# EAGLE design Blinds Driver (EAGLE 7.3.0)
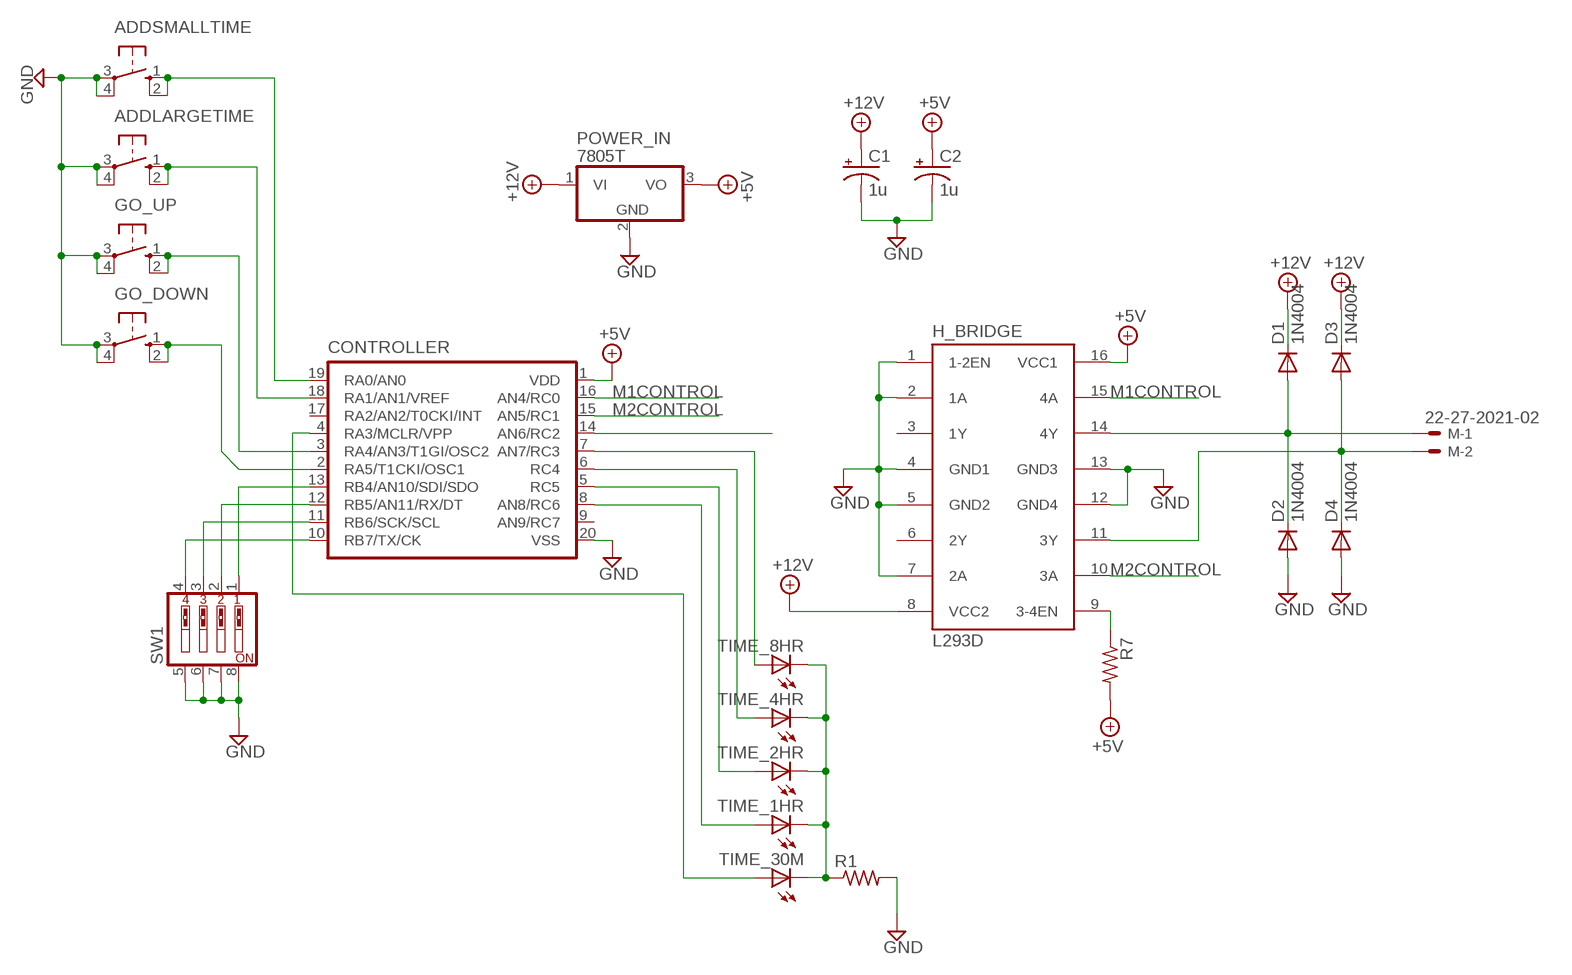
[diagram p0: schematic, sheet 1]

## Parts
ADDLARGETIME  10-XX  [B3F-10XX]
ADDSMALLTIME  10-XX  [B3F-10XX]
C1  1u  CPOL-USE2,5-6E  [E2,5-6E]
C2  1u  CPOL-USE2,5-6E  [E2,5-6E]
CONTROLLER  PIC16F6XX  [DIL20]
D1  1N4004  [DO41-10]
D2  1N4004  [DO41-10]
D3  1N4004  [DO41-10]
D4  1N4004  [DO41-10]
GO_DOWN  10-XX  [B3F-10XX]
GO_UP  10-XX  [B3F-10XX]
H_BRIDGE  L293D  [DIL16]
M  22-27-2021-02  [6410-02]
POWER_IN  7805T  [TO220H]
R1  R-US_0207/10  [0207/10]
R7  R-US_0207/10  [0207/10]
SW1  SW_DIP-4  [EDG-04]
TIME_1HR  LED5MM  [LED5MM]
TIME_2HR  LED5MM  [LED5MM]
TIME_4HR  LED5MM  [LED5MM]
TIME_8HR  LED5MM  [LED5MM]
TIME_30M  LED5MM  [LED5MM]

## Nets
+5V: C2.+ CONTROLLER.1(VDD) H_BRIDGE.16(VCC1) POWER_IN.3(VO) R7.2
+12V: C1.+ D1.C D3.C H_BRIDGE.8(VCC2) POWER_IN.1(VI)
GND: ADDLARGETIME.3(P) ADDLARGETIME.4(P1) ADDSMALLTIME.3(P) ADDSMALLTIME.4(P1) C1.- C2.- CONTROLLER.20(VSS) D2.A D4.A GO_DOWN.3(P) GO_DOWN.4(P1) GO_UP.3(P) GO_UP.4(P1) H_BRIDGE.1(1-2EN) H_BRIDGE.2(1A) H_BRIDGE.4(GND1) H_BRIDGE.5(GND2) H_BRIDGE.7(2A) H_BRIDGE.12(GND4) H_BRIDGE.13(GND3) POWER_IN.2(GND) R1.2 SW1.5 SW1.6 SW1.7 SW1.8
M1CONTROL: CONTROLLER.16(AN4/RC0) H_BRIDGE.15(4A)
M2CONTROL: CONTROLLER.15(AN5/RC1) H_BRIDGE.10(3A)
N$2: CONTROLLER.14(AN6/RC2)
N$3: D1.A D2.C H_BRIDGE.14(4Y) M.1
N$4: CONTROLLER.13(RB4/AN10/SDI/SDO) SW1.1
N$5: CONTROLLER.12(RB5/AN11/RX/DT) SW1.2
N$6: D3.A D4.C H_BRIDGE.11(3Y) M.2
N$7: CONTROLLER.11(RB6/SCK/SCL) SW1.3
N$8: H_BRIDGE.9(3-4EN) R7.1
N$9: CONTROLLER.10(RB7/TX/CK) SW1.4
N$10: CONTROLLER.7(AN7/RC3) TIME_8HR.A
N$11: CONTROLLER.6(RC4) TIME_4HR.A
N$12: CONTROLLER.5(RC5) TIME_2HR.A
N$13: CONTROLLER.8(AN8/RC6) TIME_1HR.A
N$14: R1.1 TIME_1HR.K(C) TIME_2HR.K(C) TIME_4HR.K(C) TIME_8HR.K(C) TIME_30M.K(C)
N$18: ADDSMALLTIME.1(S) ADDSMALLTIME.2(S1) CONTROLLER.19(RA0/AN0)
N$19: ADDLARGETIME.1(S) ADDLARGETIME.2(S1) CONTROLLER.18(RA1/AN1/VREF)
N$20: CONTROLLER.3(RA4/AN3/T1GI/OSC2) GO_UP.1(S) GO_UP.2(S1)
N$21: CONTROLLER.2(RA5/T1CKI/OSC1) GO_DOWN.1(S) GO_DOWN.2(S1)
N$24: CONTROLLER.4(RA3/MCLR/VPP) TIME_30M.A
Unconnected: CONTROLLER.9(AN9/RC7) CONTROLLER.17(RA2/AN2/T0CKI/INT) H_BRIDGE.3(1Y) H_BRIDGE.6(2Y)

## Library data of the parts
ADDLARGETIME ADDSMALLTIME GO_DOWN GO_UP = switch-omron:10-XX: OMRON SWITCH; MPN: B3F-1000; OC_FARNELL: 176432; OC_NEWARK: 36M3542
C1 C2 = rcl:CPOL-US: POLARIZED CAPACITOR, American symbol
CONTROLLER = pic16f690:PIC16F6XX
D1-D4 = diode:1N4004: DIODE general purpose rectifier, 1 A
H_BRIDGE = st-microelectronics:L293D: PUSH-PULL 4 CHANNEL DRIVER; MPN: L293D; OC_FARNELL: 9589619; OC_NEWARK: 56P8249
M = con-molex:22-?-02: CONNECTOR wire to board 2.54 mm (.1 inch) pitch header; OC_FARNELL: unknown; OC_NEWARK: unknown
POWER_IN = linear:78*: Positive VOLTAGE REGULATOR Source: http://cache.national.com/ds/LM/LM78L05.pdf http://www.fairchildsemi.com/ds/LM/LM7805.pdf
R1 R7 = resistor:R-US_: RESISTOR, American symbol
SW1 = special:SW_DIP-4: DIP SWITCH
TIME_1HR TIME_2HR TIME_4HR TIME_8HR TIME_30M = led:LED: LED OSRAM: - CHIPLED LG R971, LG N971, LY N971, LG Q971, LY Q971, LO R971, LY R971 LH N974, LH R974 LS Q976, LO Q976, LY Q976 LO Q996 - Hyper CHIPLED LW Q18S LB Q993, LB Q99A, LB R99A - SideLED LS A670, LO A670, LY A670, LG A670, LP A670 LB A673, LV A673, LT A673, LW A673 LH A674 LY A675 LS A676, LA A676, LO A676, LY A676, LW A676 LS A679, LY A679, LG A679 - Hyper Micro SIDELED® LS Y876, LA Y876, LO Y876, LY Y876 LT Y87S - SmartLED LW L88C, LW L88S LB L89C, LB L89S, LG L890 LS L89K, LO L89K, LY L89K LS L896, LA L896, LO L896, LY L896 - TOPLED LS T670, LO T670, LY T670, LG T670, LP T670 LSG T670, LSP T670, LSY T670, LOP T670, LYG T670 LG T671, LOG T671, LSG T671 LB T673, LV T673, LT T673, LW T673 LH T674 LS T676, LA T676, LO T676, LY T676, LB T676, LH T676, LSB T676, LW T676 LB T67C, LV T67C, LT T67C, LS T67K, LO T67K, LY T67K, LW E67C LS E67B, LA E67B, LO E67B, LY E67B, LB E67C, LV E67C, LT E67C LW T67C LS T679, LY T679, LG T679 LS T770, LO T770, LY T770, LG T770, LP T770 LB T773, LV T773, LT T773, LW T773 LH T774 LS E675, LA E675, LY E675, LS T675 LS T776, LA T776, LO T776, LY T776, LB T776 LHGB T686 LT T68C, LB T68C - Hyper Mini TOPLED® LB M676 - Mini TOPLED Santana® LG M470 LS M47K, LO M47K, LY M47K Source: http://www.osram.convergy.de LUXEON: - LUMILED® LXK2-PW12-R00, LXK2-PW12-S00, LXK2-PW14-U00, LXK2-PW14-V00 LXK2-PM12-R00, LXK2-PM12-S00, LXK2-PM14-U00 LXK2-PE12-Q00, LXK2-PE12-R00, LXK2-PE12-S00, LXK2-PE14-T00, LXK2-PE14-U00 LXK2-PB12-K00, LXK2-PB12-L00, LXK2-PB12-M00, LXK2-PB14-N00, LXK2-PB14-P00, LXK2-PB14-Q00 LXK2-PR12-L00, LXK2-PR12-M00, LXK2-PR14-Q00, LXK2-PR14-R00 LXK2-PD12-Q00, LXK2-PD12-R00, LXK2-PD12-S00 LXK2-PH12-R00, LXK2-PH12-S00 LXK2-PL12-P00, LXK2-PL12-Q00, LXK2-PL12-R00 Source: www.luxeon.com KINGBRIGHT: KA-3528ASYC Source: www.kingbright.com

## Board
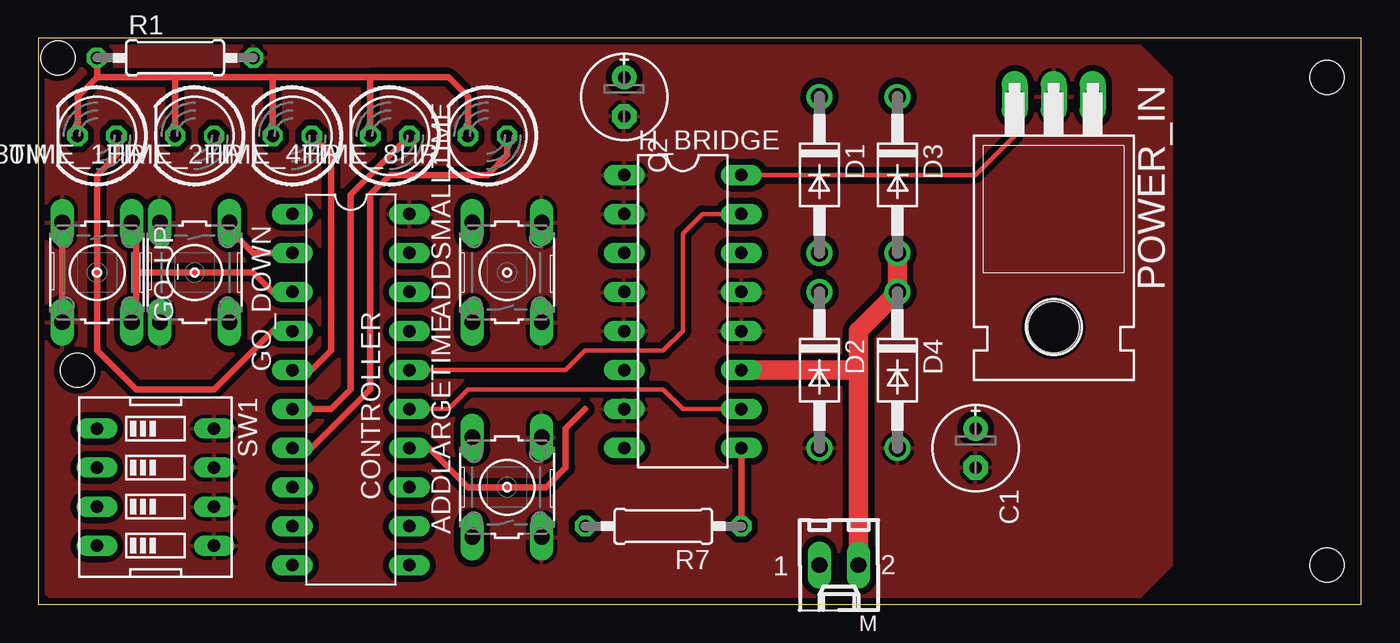
[diagram p1: board, top side]
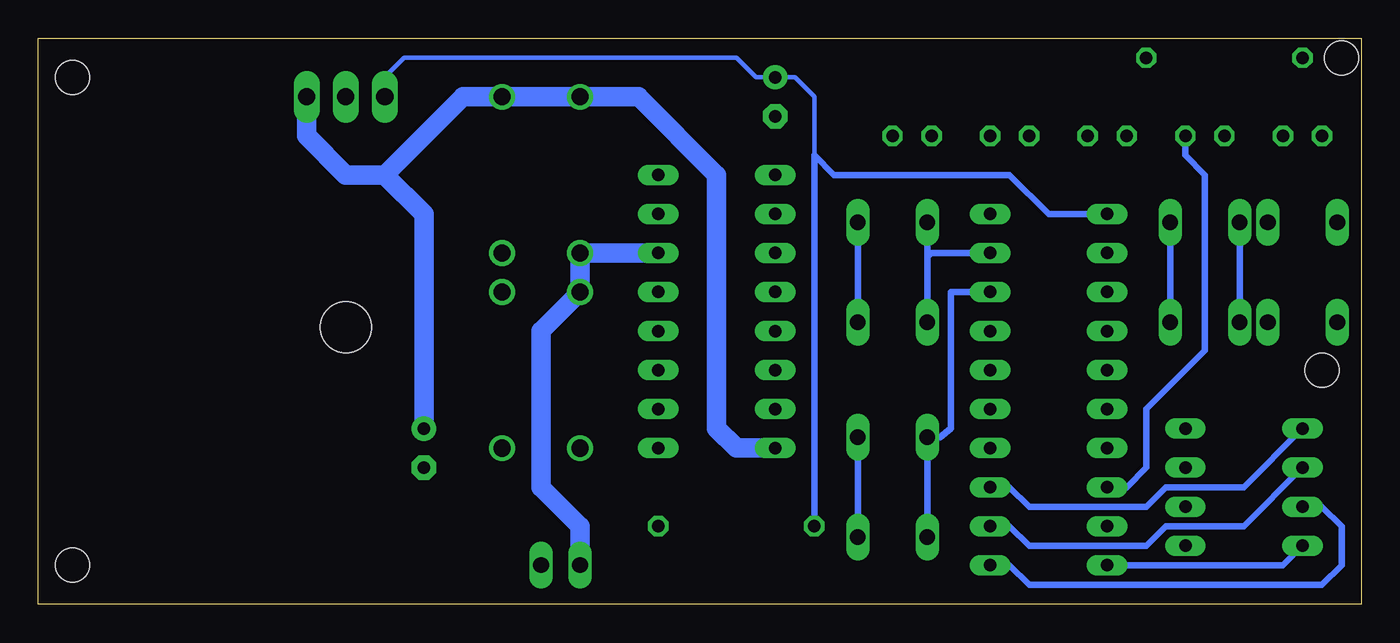
[diagram p2: board, bottom side, seen from below]

Size 86.03 x 36.82 mm. Coordinates in mm from the lower left corner, seen from the top.
Outline: 0,0 86.03,0 86.03,36.82 0,36.82 0,0
Copper layers (1*16): Top 0.035mm / dielectric 1.5mm / Bottom 0.035mm
Design rules "ITEADstudio_DRC": minimum track width 6mil, minimum drill 12mil, track to track 6mil, track to pad 6mil, pad to pad 6mil, via to via 6mil, smd to smd 0mil, copper to edge 10mil, drill to drill 10mil, minimum pad ring 10mil, minimum via ring 6mil, stop-mask expansion 2mil, vias tented up to drill 100mil, thermal gap 10mil
Holes 2.2 mm at 1.27,35.56 83.82,34.29 83.82,2.54 2.54,15.24

### Footprints (pad centres in the part's own frame; a part is rotated, then mirrored left to right if it is on the bottom)
B3F-10XX = drill 1.016 long: 1 -3.251,2.261; 2 3.251,2.261; 3 -3.251,-2.261; 4 3.251,-2.261
E2,5-6E = drill 0.813 pad 1.575: + -1.27,0 | drill 0.813 pad 1.575 octagon: - 1.27,0
DIL20 = drill 0.813 long: 1 -11.43,-3.81; 2 -8.89,-3.81; 3 -6.35,-3.81; 4 -3.81,-3.81; 5 -1.27,-3.81; 6 1.27,-3.81; 7 3.81,-3.81; 8 6.35,-3.81; 9 8.89,-3.81; 10 11.43,-3.81; 11 11.43,3.81; 12 8.89,3.81; 13 6.35,3.81; 14 3.81,3.81; 15 1.27,3.81; 16 -1.27,3.81; 17 -3.81,3.81; 18 -6.35,3.81; 19 -8.89,3.81; 20 -11.43,3.81
DO41-10 = drill 1.118: A 5.08,0; C -5.08,0
DIL16 = drill 0.813 long: 1 -8.89,-3.81; 2 -6.35,-3.81; 3 -3.81,-3.81; 4 -1.27,-3.81; 5 1.27,-3.81; 6 3.81,-3.81; 7 6.35,-3.81; 8 8.89,-3.81; 9 8.89,3.81; 10 6.35,3.81; 11 3.81,3.81; 12 1.27,3.81; 13 -1.27,3.81; 14 -3.81,3.81; 15 -6.35,3.81; 16 -8.89,3.81
6410-02 = drill 1.016 long: 1 1.27,0; 2 -1.27,0
TO220H = drill 1.118 long: 1 -2.54,-10.16; 2 0,-10.16; 3 2.54,-10.16 | hole 3.302: 0,4.826
0207/10 = drill 0.813 octagon: 1 -5.08,0; 2 5.08,0
EDG-04 = drill 0.813 long: 1 -3.81,-3.81; 2 -1.27,-3.81; 3 1.27,-3.81; 4 3.81,-3.81; 5 3.81,3.81; 6 1.27,3.81; 7 -1.27,3.81; 8 -3.81,3.81
LED5MM = drill 0.813 octagon: A -1.27,0; K 1.27,0

### Placement (x,y rotation side)
ADDLARGETIME  30.48,7.62 90 top
ADDSMALLTIME  30.48,21.59 90 top
C1  60.96,10.16 270 top
C2  38.1,33.02 270 top
CONTROLLER  20.32,13.97 270 top
D1  50.8,27.94 270 top
D2  50.8,15.24 270 top
D3  55.88,27.94 270 top
D4  55.88,15.24 270 top
GO_DOWN  10.16,21.59 270 top
GO_UP  3.81,21.59 270 top
H_BRIDGE  41.91,19.05 270 top
M  52.07,2.54 180 top
POWER_IN  66.04,22.86 180 top
R1  8.89,35.56 0 top
R7  40.64,5.08 180 top
SW1  7.62,7.62 270 top
TIME_1HR  10.16,30.48 180 top
TIME_2HR  16.51,30.48 180 top
TIME_4HR  22.86,30.48 180 top
TIME_8HR  29.21,30.48 180 top
TIME_30M  3.81,30.48 180 top

### Tracks (layer width: path | path; a pad name or v marks a point on that pad's centre or on a via)
+5V
  Top 0.305: H_BRIDGE.16 60.96,27.94 63.5,30.48 POWER_IN.3
  Bottom 0.305: 35.56,29.21 35.56,33.02 36.83,34.29 C2.+ 39.37,34.29 40.64,35.56 62.23,35.56 63.5,34.29 POWER_IN.3
  Bottom 0.406: CONTROLLER.1 20.32,25.4 22.86,27.94 34.29,27.94 35.56,29.21 R7.2
+12V
  Bottom 1.27: H_BRIDGE.8 40.64,10.16 41.91,11.43 41.91,27.94 46.99,33.02 D1.C D3.C 58.42,33.02 63.5,27.94 | 63.5,27.94 66.04,27.94 68.58,30.48 POWER_IN.1 | C1.+ 60.96,25.4 63.5,27.94
GND
  Top 0.406: GO_UP.3 GO_UP.4
  Bottom 0.406: GO_DOWN.3 GO_DOWN.4 | ADDSMALLTIME.4 ADDSMALLTIME.3 | ADDLARGETIME.4 ADDLARGETIME.3
  pour Top (isolate 0.406): 0,1.27 0,34.29 2.54,36.83 71.12,36.83 73.66,34.29 73.66,2.54 71.12,0 1.27,0
M1CONTROL
  Top 0.305: CONTROLLER.16 34.29,15.24 35.56,16.51 40.64,16.51 41.91,17.78 41.91,24.13 43.18,25.4 H_BRIDGE.15
M2CONTROL
  Top 0.305: H_BRIDGE.10 41.91,12.7 40.64,13.97 27.94,13.97 26.67,12.7 CONTROLLER.15
N$2
  Top 0.406: CONTROLLER.14 25.4,10.16 27.94,7.62 33.02,7.62 34.29,8.89 34.29,11.43 35.56,12.7
N$3
  Bottom 1.27: M.1 50.8,5.08 53.34,7.62 53.34,17.78 D2.C D1.A H_BRIDGE.14
N$4
  Bottom 0.406: SW1.1 7.62,7.62 12.7,7.62 13.97,6.35 21.59,6.35 22.86,7.62 CONTROLLER.13
N$5
  Bottom 0.406: SW1.2 7.62,5.08 12.7,5.08 13.97,3.81 21.59,3.81 22.86,5.08 CONTROLLER.12
N$6
  Top 1.27: H_BRIDGE.11 53.34,15.24 | 53.34,15.24 53.34,17.78 D4.C D3.A | 53.34,15.24 M.2
N$7
  Bottom 0.406: SW1.3 2.54,6.35 1.27,5.08 1.27,2.54 2.54,1.27 21.59,1.27 22.86,2.54 CONTROLLER.11
N$8
  Top 0.406: H_BRIDGE.9 R7.1
N$9
  Bottom 0.406: SW1.4 5.08,2.54 CONTROLLER.10
N$10
  Top 0.406: CONTROLLER.7 17.78,10.16 21.59,13.97 21.59,26.67 22.86,27.94 29.21,27.94 30.48,29.21 TIME_8HR.A
N$11
  Top 0.406: CONTROLLER.6 19.05,12.7 20.32,13.97 20.32,26.67 TIME_4HR.A
N$12
  Top 0.406: CONTROLLER.5 17.78,15.24 19.05,16.51 19.05,29.21 TIME_2HR.A
N$13
  Bottom 0.406: CONTROLLER.8 15.24,7.62 13.97,8.89 13.97,12.7 10.16,16.51 10.16,27.94 11.43,29.21 TIME_1HR.A
N$14
  Top 0.406: TIME_8HR.K 27.94,33.02 26.67,34.29 21.59,34.29 | 21.59,34.29 TIME_4HR.K | TIME_2HR.K 15.24,34.29 | 15.24,34.29 21.59,34.29 | TIME_1HR.K 8.89,34.29 | 8.89,34.29 15.24,34.29 | TIME_30M.K 2.54,33.02 3.81,34.29 | 3.81,34.29 8.89,34.29 | R1.1 3.81,34.29
N$18
  Bottom 0.406: CONTROLLER.19 27.94,22.86 28.22,22.58 ADDSMALLTIME.2 ADDSMALLTIME.1
N$19
  Bottom 0.406: CONTROLLER.18 26.67,20.32 26.67,11.43 27.38,10.87 ADDLARGETIME.2 ADDLARGETIME.1
N$20
  Top 0.406: CONTROLLER.3 15.24,20.32 13.97,21.59 6.35,21.59 | 6.35,21.59 6.35,18.62 GO_UP.2 | GO_UP.1 6.35,24.56 6.35,21.59
N$21
  Top 0.406: CONTROLLER.2 13.97,22.86 12.7,24.13 12.7,24.56 GO_DOWN.1
  Bottom 0.406: GO_DOWN.1 GO_DOWN.2
N$24
  Top 0.406: CONTROLLER.4 15.24,17.78 11.43,13.97 6.35,13.97 3.81,16.51 3.81,27.94 5.08,29.21 TIME_30M.A